# Altium schematic sheet SH2 - CONNECTORS_1.SchDoc: Connectors 1
size B; CheckedBy: Lance Bantoto; DrawnBy: Kyle Hong; Engineer: Kyle Hong; Revision: 2; SheetNumber: 2; SheetTotal: 8
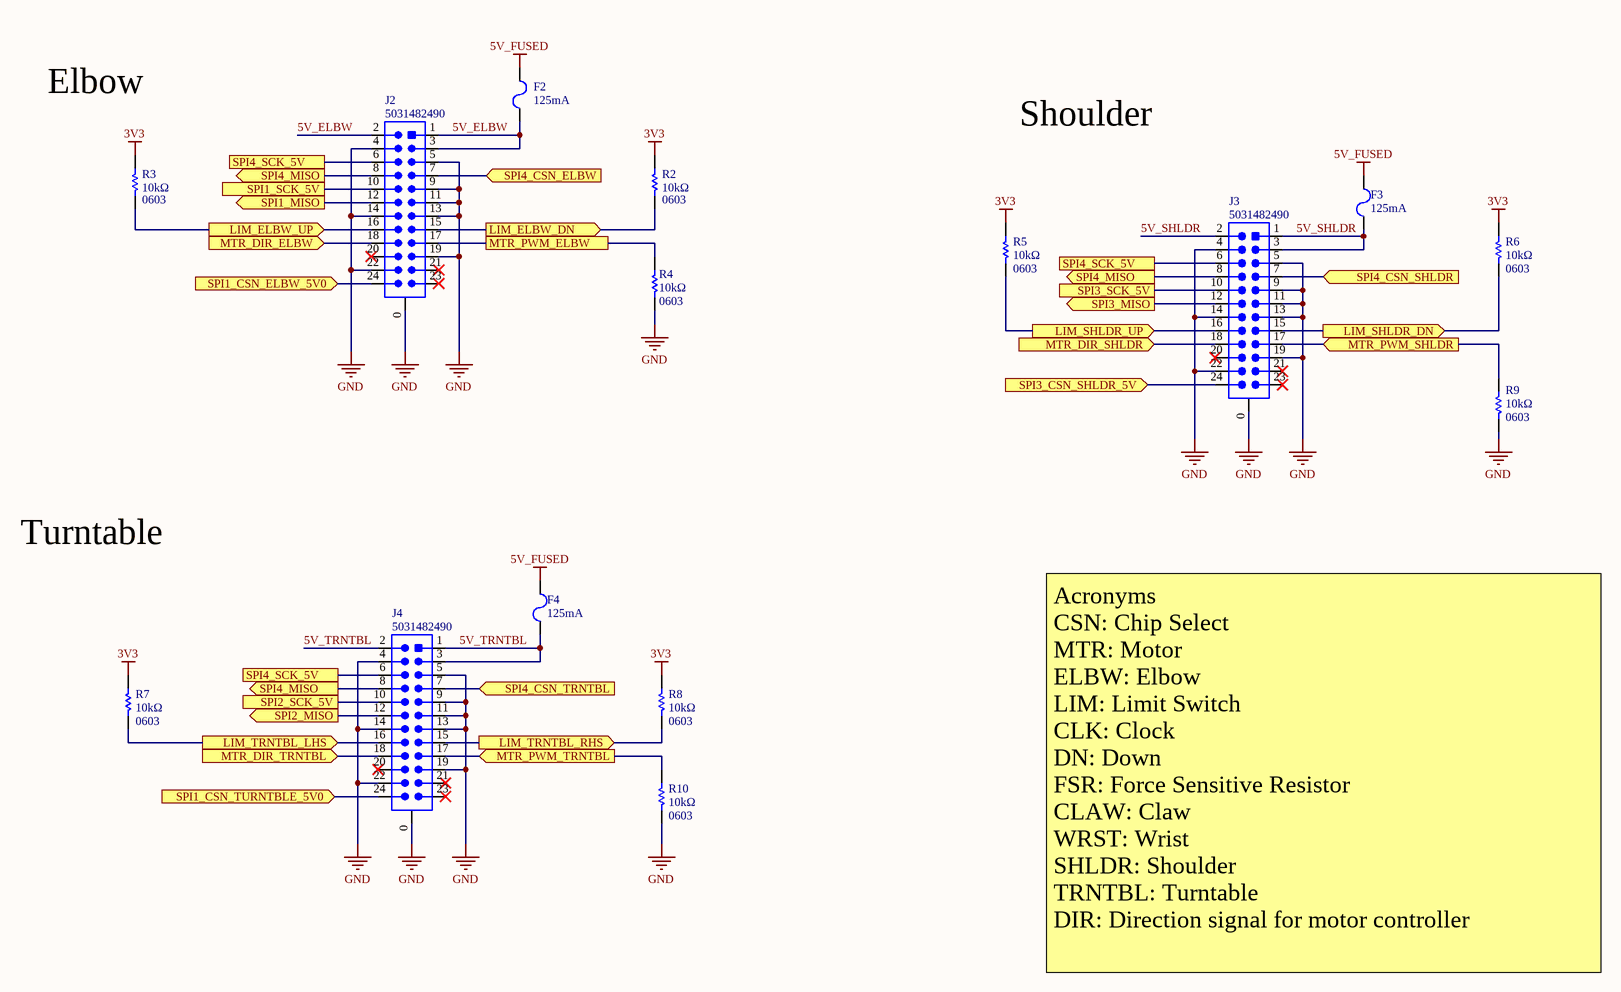
[diagram p0: SH2 - CONNECTORS_1.SchDoc]

## Parts
F2  Current Rating: 125mA  [FUSE_1206]  (hidden comment: FUSE_125mA_1206)
F3  Current Rating: 125mA  [FUSE_1206]  (hidden comment: FUSE_125mA_1206)
F4  Current Rating: 125mA  [FUSE_1206]  (hidden comment: FUSE_125mA_1206)
J2  Manufacturer Part Number 1: 5031482490  [MOLEX-5031482490]  (hidden comment: CON_12x2M_SM_RA)
J3  Manufacturer Part Number 1: 5031482490  [MOLEX-5031482490]  (hidden comment: CON_12x2M_SM_RA)
J4  Manufacturer Part Number 1: 5031482490  [MOLEX-5031482490]  (hidden comment: CON_12x2M_SM_RA)
R2  value 10kΩ  Package/Footprint: 0603  [RESC0603]  (hidden comment: RES_10kΩ_0603_5%)
R3  value 10kΩ  Package/Footprint: 0603  [RESC0603]  (hidden comment: RES_10kΩ_0603_5%)
R4  value 10kΩ  Package/Footprint: 0603  [RESC0603]  (hidden comment: RES_10kΩ_0603_5%)
R5  value 10kΩ  Package/Footprint: 0603  [RESC0603]  (hidden comment: RES_10kΩ_0603_5%)
R6  value 10kΩ  Package/Footprint: 0603  [RESC0603]  (hidden comment: RES_10kΩ_0603_5%)
R7  value 10kΩ  Package/Footprint: 0603  [RESC0603]  (hidden comment: RES_10kΩ_0603_5%)
R8  value 10kΩ  Package/Footprint: 0603  [RESC0603]  (hidden comment: RES_10kΩ_0603_5%)
R9  value 10kΩ  Package/Footprint: 0603  [RESC0603]  (hidden comment: RES_10kΩ_0603_5%)
R10  value 10kΩ  Package/Footprint: 0603  [RESC0603]  (hidden comment: RES_10kΩ_0603_5%)

## Ports
LIM_ELBW_DN (out), LIM_ELBW_UP (out), LIM_SHLDR_DN (out), LIM_SHLDR_UP (out), LIM_TRNTBL_LHS (out), LIM_TRNTBL_RHS (out), MTR_DIR_ELBW (in), MTR_DIR_SHLDR (in), MTR_DIR_TRNTBL (in), MTR_PWM_ELBW, MTR_PWM_SHLDR (in), MTR_PWM_TRNTBL (in), SPI1_CSN_ELBW_5V0 (in), SPI1_CSN_TURNTBLE_5V0 (in), SPI1_MISO (out), SPI1_SCK_5V, SPI2_MISO (out), SPI2_SCK_5V, SPI3_CSN_SHLDR_5V (in), SPI3_MISO (out), SPI3_SCK_5V, SPI4_CSN_ELBW (in), SPI4_CSN_SHLDR (in), SPI4_CSN_TRNTBL (in), SPI4_MISO (out), SPI4_SCK_5V

## Nets
3V3: R2.2 R3.2 R5.2 R6.2 R7.2 R8.2
5V_FUSED: F2.2 F3.2 F4.2
GND: J2.0 J2.4 J2.5 J2.9 J2.11 J2.13 J2.14 J2.19 J2.22 J3.0 J3.4 J3.5 J3.9 J3.11 J3.13 J3.14 J3.19 J3.22 J4.0 J4.4 J4.5 J4.9 J4.11 J4.13 J4.14 J4.19 J4.22 R4.1 R9.1 R10.1
5V_ELBW: F2.1 J2.1 J2.2 J2.3
5V_SHLDR: F3.1 J3.1 J3.2 J3.3
5V_TRNTBL: F4.1 J4.1 J4.2 J4.3
LIM_ELBW_DN: J2.15 R2.1 ; port LIM_ELBW_DN
LIM_ELBW_UP: J2.16 R3.1 ; port LIM_ELBW_UP
LIM_SHLDR_DN: J3.15 R6.1 ; port LIM_SHLDR_DN
LIM_SHLDR_UP: J3.16 R5.1 ; port LIM_SHLDR_UP
LIM_TRNTBL_LHS: J4.16 R7.1 ; port LIM_TRNTBL_LHS
LIM_TRNTBL_RHS: J4.15 R8.1 ; port LIM_TRNTBL_RHS
MTR_DIR_ELBW: J2.18 ; port MTR_DIR_ELBW
MTR_DIR_SHLDR: J3.18 ; port MTR_DIR_SHLDR
MTR_DIR_TRNTBL: J4.18 ; port MTR_DIR_TRNTBL
MTR_PWM_ELBW: J2.17 R4.2 ; port MTR_PWM_ELBW
MTR_PWM_SHLDR: J3.17 R9.2 ; port MTR_PWM_SHLDR
MTR_PWM_TRNTBL: J4.17 R10.2 ; port MTR_PWM_TRNTBL
SPI1_CSN_ELBW_5V0: J2.24 ; port SPI1_CSN_ELBW_5V0
SPI1_CSN_TURNTBLE_5V0: J4.24 ; port SPI1_CSN_TURNTBLE_5V0
SPI1_MISO: J2.12 ; port SPI1_MISO
SPI1_SCK_5V: J2.10 ; port SPI1_SCK_5V
SPI2_MISO: J4.12 ; port SPI2_MISO
SPI2_SCK_5V: J4.10 ; port SPI2_SCK_5V
SPI3_CSN_SHLDR_5V: J3.24 ; port SPI3_CSN_SHLDR_5V
SPI3_MISO: J3.12 ; port SPI3_MISO
SPI3_SCK_5V: J3.10 ; port SPI3_SCK_5V
SPI4_CSN_ELBW: J2.7 ; port SPI4_CSN_ELBW
SPI4_CSN_SHLDR: J3.7 ; port SPI4_CSN_SHLDR
SPI4_CSN_TRNTBL: J4.7 ; port SPI4_CSN_TRNTBL
SPI4_MISO: J2.8 J3.8 J4.8 ; port SPI4_MISO
SPI4_SCK_5V: J2.6 J3.6 J4.6 ; port SPI4_SCK_5V

Not connected (* = marked no-connect by the designer): J2 20* 21* 23*; J3 20* 21* 23*; J4 20* 21* 23*

## Notes on the sheet
- Elbow
- Shoulder
- Turntable
- Acronyms
  CSN: Chip Select
  MTR: Motor
  ELBW: Elbow
  LIM: Limit Switch
  CLK: Clock
  DN: Down
  FSR: Force Sensitive Resistor
  CLAW: Claw
  WRST: Wrist
  SHLDR: Shoulder
  TRNTBL: Turntable
  DIR: Direction signal for motor controller
- Title:
- Project:
- Date:
- Rev:
- Reviewer:
- Engineer:
- Sheet:
- of

## Library data of the parts
F2-F4 = FUSE_125mA_1206: FUSE BOARD MNT 125MA 125VAC/VDC; Manufacturer 1: Littelfuse; Manufacturer Part Number 1: 0466.125NR; Voltage Rating (DC): 125V; Package/Footprint: 1206; Supplier 1: Digi-Key; Supplier Part Number 1: F1450CT-ND; Mounting Type: SMD
J2-J4 = CON_12x2M_SM_RA: CONN HEADER SMD RIGHT ANGLE 1.5MM PITCH; Manufacturer 1: Molex; Voltage Rating: 100V; Current Rating: 2A; Supplier 1: Digi-Key; Orientation: Right Angle; Pitch: 1.5mm; Supplier Part Number 1: WM20820CT-ND; Family: CLIK-Mate; Mounting Type: SMD; Package/Footprint: SMD
R2-R10 = RES_10kΩ_0603_5%: RES 10K OHM 5% 1/10W 0603; Manufacturer 1: Yageo; Manufacturer Part Number 1: RC0603JR-0710KL; Supplier Part Number 1: 311-10KGRCT-ND; Supplier 1: Digi-Key; Mounting Type: SMD